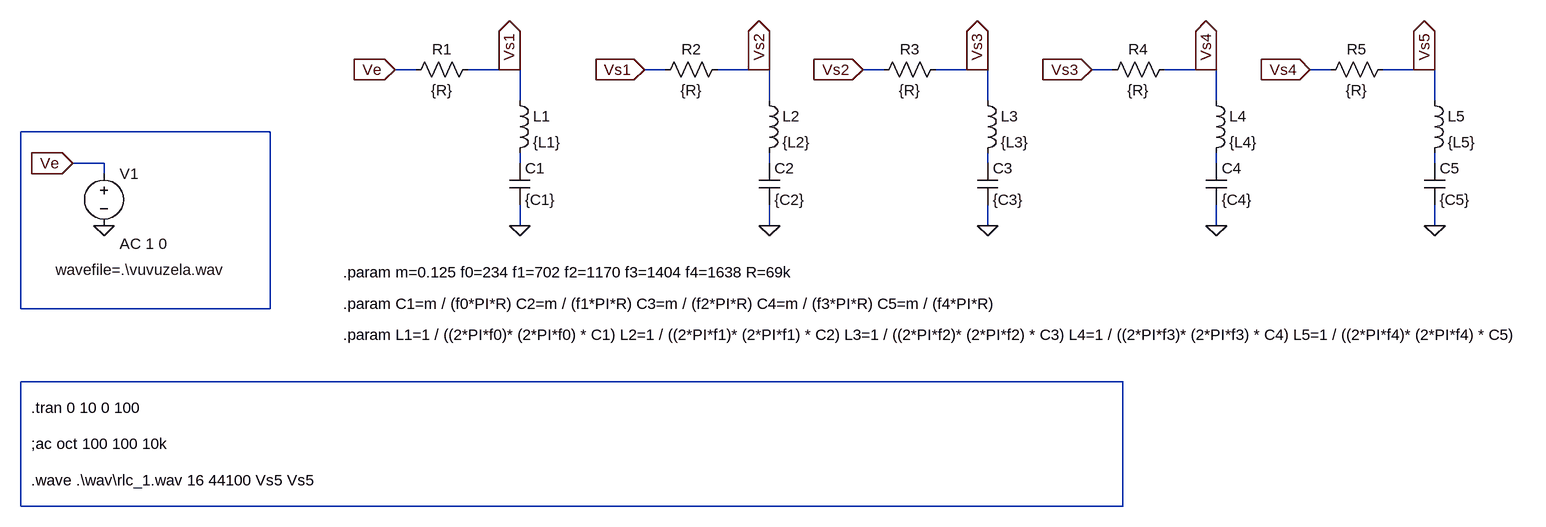
[diagram p0: schematic passiv_RLC.asc]
passiv_RLC.asc, the LTspice schematic file:
Version 4
SHEET 1 2588 680
WIRE 496 -80 464 -80
WIRE 640 -80 576 -80
WIRE 656 -80 640 -80
WIRE 880 -80 848 -80
WIRE 1024 -80 960 -80
WIRE 1040 -80 1024 -80
WIRE 1216 -80 1184 -80
WIRE 1360 -80 1296 -80
WIRE 1376 -80 1360 -80
WIRE 1568 -80 1536 -80
WIRE 1712 -80 1648 -80
WIRE 1728 -80 1712 -80
WIRE 1904 -80 1872 -80
WIRE 2048 -80 1984 -80
WIRE 2064 -80 2048 -80
WIRE 656 -32 656 -80
WIRE 1040 -32 1040 -80
WIRE 1376 -32 1376 -80
WIRE 1728 -32 1728 -80
WIRE 2064 -32 2064 -80
WIRE 272 16 -112 16
WIRE 16 64 -32 64
WIRE 656 64 656 48
WIRE 1040 64 1040 48
WIRE 1376 64 1376 48
WIRE 1728 64 1728 48
WIRE 2064 64 2064 48
WIRE 16 80 16 64
WIRE 656 160 656 128
WIRE 1040 160 1040 128
WIRE 1376 160 1376 128
WIRE 1728 160 1728 128
WIRE 2064 160 2064 128
WIRE -112 288 -112 16
WIRE 272 288 272 16
WIRE 272 288 -112 288
WIRE 1584 400 -112 400
WIRE -112 592 -112 400
WIRE 1584 592 1584 400
WIRE 1584 592 -112 592
FLAG 656 160 0
FLAG 464 -80 Ve
IOPIN 464 -80 In
FLAG 640 -80 Vs1
IOPIN 640 -80 Out
FLAG 1040 160 0
FLAG 848 -80 Vs1
IOPIN 848 -80 In
FLAG 1024 -80 Vs2
IOPIN 1024 -80 Out
FLAG 1376 160 0
FLAG 1184 -80 Vs2
IOPIN 1184 -80 In
FLAG 1360 -80 Vs3
IOPIN 1360 -80 Out
FLAG 1728 160 0
FLAG 1536 -80 Vs3
IOPIN 1536 -80 In
FLAG 1712 -80 Vs4
IOPIN 1712 -80 Out
FLAG 2064 160 0
FLAG 1872 -80 Vs4
IOPIN 1872 -80 In
FLAG 2048 -80 Vs5
IOPIN 2048 -80 Out
FLAG 16 160 0
FLAG -32 64 Ve
IOPIN -32 64 In
SYMBOL res 592 -96 R90
WINDOW 0 0 56 VBottom 2
WINDOW 3 32 56 VTop 2
SYMATTR InstName R1
SYMATTR Value {R}
SYMBOL ind 640 -48 R0
SYMATTR InstName L1
SYMATTR Value {L1}
SYMBOL cap 640 64 R0
SYMATTR InstName C1
SYMATTR Value {C1}
SYMBOL res 976 -96 R90
WINDOW 0 0 56 VBottom 2
WINDOW 3 32 56 VTop 2
SYMATTR InstName R2
SYMATTR Value {R}
SYMBOL ind 1024 -48 R0
SYMATTR InstName L2
SYMATTR Value {L2}
SYMBOL cap 1024 64 R0
SYMATTR InstName C2
SYMATTR Value {C2}
SYMBOL res 1312 -96 R90
WINDOW 0 0 56 VBottom 2
WINDOW 3 32 56 VTop 2
SYMATTR InstName R3
SYMATTR Value {R}
SYMBOL ind 1360 -48 R0
SYMATTR InstName L3
SYMATTR Value {L3}
SYMBOL cap 1360 64 R0
SYMATTR InstName C3
SYMATTR Value {C3}
SYMBOL res 1664 -96 R90
WINDOW 0 0 56 VBottom 2
WINDOW 3 32 56 VTop 2
SYMATTR InstName R4
SYMATTR Value {R}
SYMBOL ind 1712 -48 R0
SYMATTR InstName L4
SYMATTR Value {L4}
SYMBOL cap 1712 64 R0
SYMATTR InstName C4
SYMATTR Value {C4}
SYMBOL res 2000 -96 R90
WINDOW 0 0 56 VBottom 2
WINDOW 3 32 56 VTop 2
SYMATTR InstName R5
SYMATTR Value {R}
SYMBOL ind 2048 -48 R0
SYMATTR InstName L5
SYMATTR Value {L5}
SYMBOL cap 2048 64 R0
SYMATTR InstName C5
SYMATTR Value {C5}
SYMBOL voltage 16 64 R0
WINDOW 3 -74 164 Left 2
WINDOW 123 24 124 Left 2
WINDOW 39 0 0 Left 0
SYMATTR Value wavefile=.\vuvuzela.wav
SYMATTR Value2 AC 1 0
SYMATTR InstName V1
TEXT 384 232 Left 2 !.param m=0.125 f0=234 f1=702 f2=1170 f3=1404 f4=1638 R=69k
TEXT 384 328 Left 2 !.param L1=1 / ((2*PI*f0)* (2*PI*f0) * C1) L2=1 / ((2*PI*f1)* (2*PI*f1) * C2) L3=1 / ((2*PI*f2)* (2*PI*f2) * C3) L4=1 / ((2*PI*f3)* (2*PI*f3) * C4) L5=1 / ((2*PI*f4)* (2*PI*f4) * C5)
TEXT -96 440 Left 2 !.tran 0 10 0 100
TEXT 384 280 Left 2 !.param C1=m / (f0*PI*R) C2=m / (f1*PI*R) C3=m / (f2*PI*R) C4=m / (f3*PI*R) C5=m / (f4*PI*R)
TEXT -96 552 Left 2 !.wave .\\wav\\rlc_1.wav 16 44100 Vs5 Vs5
TEXT -96 496 Left 2 !;ac oct 100 100 10k

The netlist it stands for:
* passiv_RLC.asc
R1 Vs1 Ve {R}
L1 Vs1 N002 {L1}
C1 N002 0 {C1}
R2 Vs2 Vs1 {R}
L2 Vs2 N003 {L2}
C2 N003 0 {C2}
R3 Vs3 Vs2 {R}
L3 Vs3 N004 {L3}
C3 N004 0 {C3}
R4 Vs4 Vs3 {R}
L4 Vs4 N005 {L4}
C4 N005 0 {C4}
R5 Vs5 Vs4 {R}
L5 Vs5 N006 {L5}
C5 N006 0 {C5}
V1 Ve 0 wavefile=.\vuvuzela.wav AC 1 0
.param m=0.125 f0=234 f1=702 f2=1170 f3=1404 f4=1638 R=69k
.param L1=1 / ((2*PI*f0)* (2*PI*f0) * C1) L2=1 / ((2*PI*f1)* (2*PI*f1) * C2) L3=1 / ((2*PI*f2)* (2*PI*f2) * C3) L4=1 / ((2*PI*f3)* (2*PI*f3) * C4) L5=1 / ((2*PI*f4)* (2*PI*f4) * C5)
.tran 0 10 0 100
.param C1=m / (f0*PI*R) C2=m / (f1*PI*R) C3=m / (f2*PI*R) C4=m / (f3*PI*R) C5=m / (f4*PI*R)
.wave .\wav\rlc_1.wav 16 44100 Vs5 Vs5
;ac oct 100 100 10k
.backanno
.end